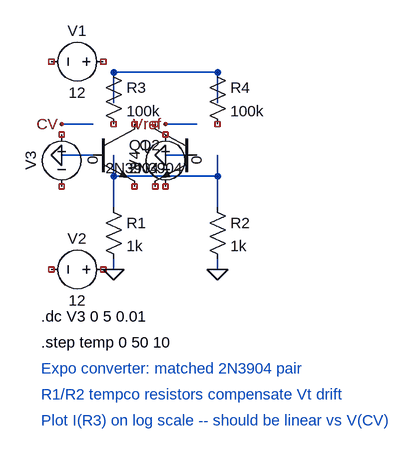
[diagram p0: schematic expo-converter.asc]
expo-converter.asc, the LTspice schematic file:
Version 4
SHEET 1 1200 800
WIRE 208 160 208 112
WIRE 208 272 208 240
WIRE 368 160 368 112
WIRE 368 272 368 240
WIRE 208 112 368 112
WIRE 208 272 368 272
WIRE 128 192 176 192
WIRE 128 240 176 240
WIRE 288 192 336 192
WIRE 288 240 336 240
WIRE 208 320 208 272
WIRE 368 320 368 272
WIRE 208 416 208 400
WIRE 368 416 368 400
FLAG 208 416 0
FLAG 368 416 0
FLAG 128 192 CV
FLAG 128 240 0
FLAG 288 240 0
FLAG 288 192 Vref
SYMBOL npn 176 192 R0
SYMATTR InstName Q1
SYMATTR Value 2N3904
SYMBOL npn 336 192 M0
SYMATTR InstName Q2
SYMATTR Value 2N3904
SYMBOL res 192 304 R0
SYMATTR InstName R1
SYMATTR Value 1k
SYMATTR SpiceLine tc1=3.353e-3 tc2=0
SYMBOL res 352 304 R0
SYMATTR InstName R2
SYMATTR Value 1k
SYMATTR SpiceLine tc1=3.353e-3 tc2=0
SYMBOL res 192 96 R0
SYMATTR InstName R3
SYMATTR Value 100k
SYMBOL res 352 96 R0
SYMATTR InstName R4
SYMATTR Value 100k
SYMBOL voltage 208 96 R90
WINDOW 0 -32 56 VBottom 2
WINDOW 3 32 56 VTop 2
SYMATTR InstName V1
SYMATTR Value 12
SYMBOL voltage 208 416 R90
WINDOW 0 -32 56 VBottom 2
WINDOW 3 32 56 VTop 2
SYMATTR InstName V2
SYMATTR Value 12
SYMBOL voltage 128 192 R0
WINDOW 0 -32 56 VBottom 2
WINDOW 3 32 56 VTop 2
SYMATTR InstName V3
SYMATTR Value 0
SYMBOL voltage 288 192 R0
WINDOW 0 -32 56 VBottom 2
WINDOW 3 32 56 VTop 2
SYMATTR InstName V4
SYMATTR Value 0
TEXT 96 488 Left 2 !.dc V3 0 5 0.01
TEXT 96 528 Left 2 !.step temp 0 50 10
TEXT 96 568 Left 2 ;Expo converter: matched 2N3904 pair
TEXT 96 608 Left 2 ;R1/R2 tempco resistors compensate Vt drift
TEXT 96 648 Left 2 ;Plot I(R3) on log scale -- should be linear vs V(CV)

The netlist it stands for:
* expo-converter.asc
* Q1: 2N3904 (symbol npn not certain, pin order unknown); nets seen at it: 0
* Q2: 2N3904 (symbol npn not certain, pin order unknown); nets seen at it: 0
R1 N002 0 1k tc1=3.353e-3 tc2=0
R2 N002 0 1k tc1=3.353e-3 tc2=0
R3 N001 NC_05 100k
R4 N001 NC_06 100k
V1 NC_07 NC_08 12
V2 NC_09 NC_10 12
V3 NC_11 NC_12 0
V4 NC_13 NC_14 0
.dc V3 0 5 0.01
.step temp 0 50 10
* Expo converter: matched 2N3904 pair
* R1/R2 tempco resistors compensate Vt drift
* Plot I(R3) on log scale -- should be linear vs V(CV)
.backanno
.end